# Altium schematic sheet Processing.SchDoc
size A3
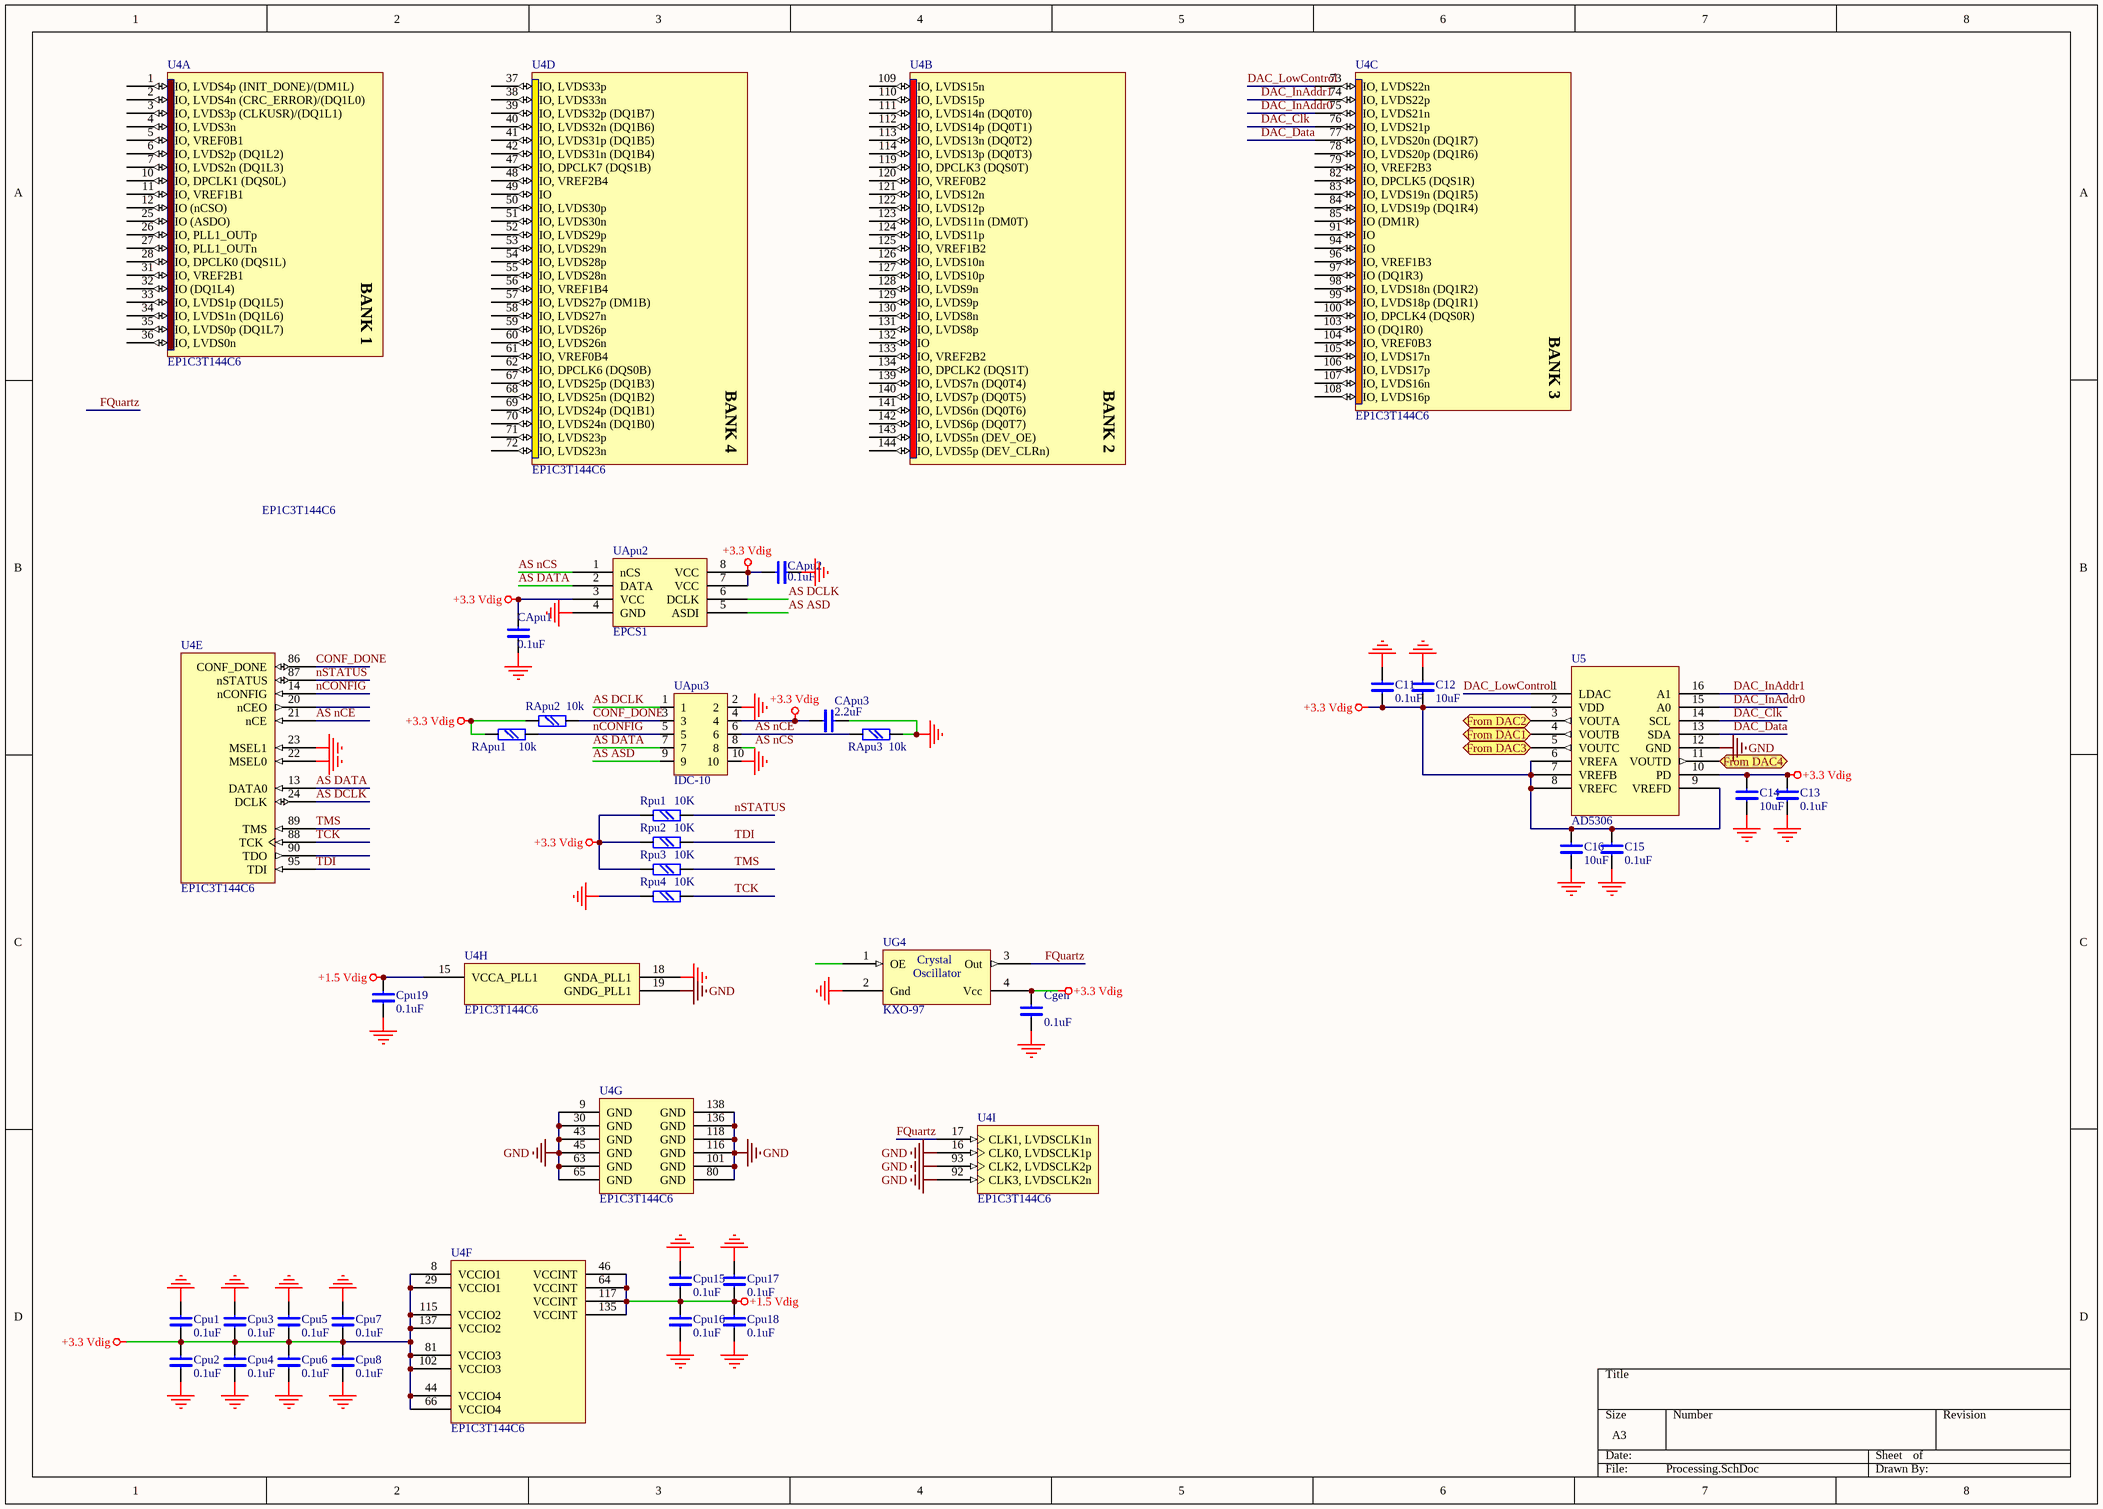
[diagram p0: Processing.SchDoc]

## Parts
C11  0.1uF  [chip0805]
C12  10uF  [chip1206]
C13  0.1uF  [chip0805]
C14  10uF  [chip1206]
C15  0.1uF  [chip0805]
C16  10uF  [chip1206]
CApu1  0.1uF  [chip0805]
CApu2  0.1uF  [chip0805]
CApu3  2.2uF  [chip0805]
Cgen  0.1uF  [chip0805]
Cpu1  0.1uF  [chip0805]
Cpu2  0.1uF  [chip0805]
Cpu3  0.1uF  [chip0805]
Cpu4  0.1uF  [chip0805]
Cpu5  0.1uF  [chip0805]
Cpu6  0.1uF  [chip0805]
Cpu7  0.1uF  [chip0805]
Cpu8  0.1uF  [chip0805]
Cpu15  0.1uF  [chip0805]
Cpu16  0.1uF  [chip0805]
Cpu17  0.1uF  [chip0805]
Cpu18  0.1uF  [chip0805]
Cpu19  0.1uF  [chip0805]
RApu1  10k  [chip0805]
RApu2  10k  [chip0805]
RApu3  10k  [chip0805]
Rpu1  10K  [chip0805]
Rpu2  10K  [chip0805]
Rpu3  10K  [chip0805]
Rpu4  10K  [chip0805]
U4  EP1C3T144C6  [TQFP144_N]  (parts A,B,C,D,E,F,G,H,I of 9)
U5  AD5306  [RU-16]
UApu2  EPCS1  [8SO200]
UApu3  IDC-10  [IDC10]
UG4  KXO-97  [SG-636]

## Ports
From DAC1 (out), From DAC2 (out), From DAC3 (out), From DAC4 (out)

## Nets
+1.5 Vdig: Cpu15.1 Cpu16.1 Cpu17.1 Cpu18.1 Cpu19.1 U4.15(VCCA_PLL1) U4.46(VCCINT) U4.64(VCCINT) U4.117(VCCINT) U4.135(VCCINT)
+3.3 Vdig: C11.1 C12.1 C13.1 C14.1 C15.1 C16.1 CApu1.2 CApu2.2 CApu3.1 Cgen.2 Cpu1.1 Cpu2.1 Cpu3.1 Cpu4.1 Cpu5.1 Cpu6.1 Cpu7.1 Cpu8.1 RApu1.1 RApu2.1 Rpu1.1 Rpu2.1 Rpu3.1 U4.8(VCCIO1) U4.29(VCCIO1) U4.44(VCCIO4) U4.66(VCCIO4) U4.81(VCCIO3) U4.102(VCCIO3) U4.115(VCCIO2) U4.137(VCCIO2) U5.2(VDD) U5.6(VREFA) U5.7(VREFB) U5.8(VREFC) U5.9(VREFD) U5.10(PD) UApu2.3(VCC) UApu2.7(VCC) UApu2.8(VCC) UApu3.4 UG4.4(Vcc)
GND: C11.2 C12.2 C13.2 C14.2 C15.2 C16.2 CApu1.1 CApu2.1 CApu3.2 Cgen.1 Cpu1.2 Cpu2.2 Cpu3.2 Cpu4.2 Cpu5.2 Cpu6.2 Cpu7.2 Cpu8.2 Cpu15.2 Cpu16.2 Cpu17.2 Cpu18.2 Cpu19.2 RApu3.2 Rpu4.1 U4.9(GND) U4.16(CLK0,_LVDSCLK1p) U4.18(GNDA_PLL1) U4.19(GNDG_PLL1) U4.22(MSEL0) U4.23(MSEL1) U4.30(GND) U4.43(GND) U4.45(GND) U4.63(GND) U4.65(GND) U4.80(GND) U4.92(CLK3,_LVDSCLK2n) U4.93(CLK2,_LVDSCLK2p) U4.101(GND) U4.116(GND) U4.118(GND) U4.136(GND) U4.138(GND) U5.12(GND) UApu2.4(GND) UApu3.2 UApu3.10 UG4.2(Gnd)
AS ASD: UApu2.5(ASDI) UApu3.9
AS DATA: U4.13(DATA0) UApu2.2(DATA) UApu3.7
AS DCLK: U4.24(DCLK) UApu2.6(DCLK) UApu3.1
AS nCE: RApu3.1 U4.21(nCE) UApu3.6
AS nCS: UApu2.1(nCS) UApu3.8
CONF_DONE: RApu2.2 U4.86(CONF_DONE) UApu3.3
DAC_Clk: U4.76(IO,_LVDS21p) U5.14(SCL)
DAC_Data: U4.77(IO,_LVDS20n_(DQ1R7)) U5.13(SDA)
DAC_InAddr0: U4.75(IO,_LVDS21n) U5.15(A0)
DAC_InAddr1: U4.74(IO,_LVDS22p) U5.16(A1)
DAC_LowControl: U4.73(IO,_LVDS22n) U5.1(LDAC)
FQuartz: U4.17(CLK1,_LVDSCLK1n) UG4.3(Out)
From DAC1: U5.4(VOUTB) ; port From DAC1
From DAC2: U5.3(VOUTA) ; port From DAC2
From DAC3: U5.5(VOUTC) ; port From DAC3
From DAC4: U5.11(VOUTD) ; port From DAC4
nCONFIG: RApu1.2 U4.14(nCONFIG) UApu3.5
nSTATUS: Rpu1.2 U4.87(nSTATUS)
TCK: Rpu4.2 U4.88(TCK)
TDI: Rpu2.2 U4.95(TDI)
TMS: Rpu3.2 U4.89(TMS)

Not connected (* = marked no-connect by the designer): U4 1(IO,_LVDS4p_(INIT_DONE)/(DM1L)) 2(IO,_LVDS4n_(CRC_ERROR)/(DQ1L0)) 3(IO,_LVDS3p_(CLKUSR)/(DQ1L1)) 4(IO,_LVDS3n) 5(IO,_VREF0B1) 6(IO,_LVDS2p_(DQ1L2)) 7(IO,_LVDS2n_(DQ1L3)) 10(IO,_DPCLK1_(DQS0L)) 11(IO,_VREF1B1) 12(IO_(nCSO)) 20(nCEO) 25(IO_(ASDO)) 26(IO,_PLL1_OUTp) 27(IO,_PLL1_OUTn) 28(IO,_DPCLK0_(DQS1L)) 31(IO,_VREF2B1) 32(IO_(DQ1L4)) 33(IO,_LVDS1p_(DQ1L5)) 34(IO,_LVDS1n_(DQ1L6)) 35(IO,_LVDS0p_(DQ1L7)) 36(IO,_LVDS0n) 37(IO,_LVDS33p) 38(IO,_LVDS33n) 39(IO,_LVDS32p_(DQ1B7)) 40(IO,_LVDS32n_(DQ1B6)) 41(IO,_LVDS31p_(DQ1B5)) 42(IO,_LVDS31n_(DQ1B4)) 47(IO,_DPCLK7_(DQS1B)) 48(IO,_VREF2B4) 49(IO) 50(IO,_LVDS30p) 51(IO,_LVDS30n) 52(IO,_LVDS29p) 53(IO,_LVDS29n) 54(IO,_LVDS28p) 55(IO,_LVDS28n) 56(IO,_VREF1B4) 57(IO,_LVDS27p_(DM1B)) 58(IO,_LVDS27n) 59(IO,_LVDS26p) 60(IO,_LVDS26n) 61(IO,_VREF0B4) 62(IO,_DPCLK6_(DQS0B)) 67(IO,_LVDS25p_(DQ1B3)) 68(IO,_LVDS25n_(DQ1B2)) 69(IO,_LVDS24p_(DQ1B1)) 70(IO,_LVDS24n_(DQ1B0)) 71(IO,_LVDS23p) 72(IO,_LVDS23n) 78(IO,_LVDS20p_(DQ1R6)) 79(IO,_VREF2B3) 82(IO,_DPCLK5_(DQS1R)) 83(IO,_LVDS19n_(DQ1R5)) 84(IO,_LVDS19p_(DQ1R4)) 85(IO_(DM1R)) 90(TDO) 91(IO) 94(IO) 96(IO,_VREF1B3) 97(IO_(DQ1R3)) 98(IO,_LVDS18n_(DQ1R2)) 99(IO,_LVDS18p_(DQ1R1)) 100(IO,_DPCLK4_(DQS0R)) 103(IO_(DQ1R0)) 104(IO,_VREF0B3) 105(IO,_LVDS17n) 106(IO,_LVDS17p) 107(IO,_LVDS16n) 108(IO,_LVDS16p) 109(IO,_LVDS15n) 110(IO,_LVDS15p) 111(IO,_LVDS14n_(DQ0T0)) 112(IO,_LVDS14p_(DQ0T1)) 113(IO,_LVDS13n_(DQ0T2)) 114(IO,_LVDS13p_(DQ0T3)) 119(IO,_DPCLK3_(DQS0T)) 120(IO,_VREF0B2) 121(IO,_LVDS12n) 122(IO,_LVDS12p) 123(IO,_LVDS11n_(DM0T)) 124(IO,_LVDS11p) 125(IO,_VREF1B2) 126(IO,_LVDS10n) 127(IO,_LVDS10p) 128(IO,_LVDS9n) 129(IO,_LVDS9p) 130(IO,_LVDS8n) 131(IO,_LVDS8p) 132(IO) 133(IO,_VREF2B2) 134(IO,_DPCLK2_(DQS1T)) 139(IO,_LVDS7n_(DQ0T4)) 140(IO,_LVDS7p_(DQ0T5)) 141(IO,_LVDS6n_(DQ0T6)) 142(IO,_LVDS6p_(DQ0T7)) 143(IO,_LVDS5n_(DEV_OE)) 144(IO,_LVDS5p_(DEV_CLRn)); UG4 1(OE)

## Notes on the sheet
- (in symbol EP1C3T144C6, part A) BANK 1
- (in symbol EP1C3T144C6, part B) BANK 2
- (in symbol EP1C3T144C6, part C) BANK 3
- (in symbol EP1C3T144C6, part D) BANK 4
- (in symbol SG-636) Crystal; Oscillator

## Library data of the parts
C11-C16 CApu1-CApu3 Cgen Cpu1-Cpu8 Cpu15-Cpu19 = C: Text Field1: 20; Text Field2: 10
RApu1-RApu3 Rpu1-Rpu4 = R: Text Field1: 20; Text Field2: 20
U4 = EP1C3T144C6: Cyclone Family, 1.5V FPGA, 104 I/O Pins, 1 x PLL, Commercial Grade, Speed Grade 6; Published: 17-Sep-2003; LatestRevisionDate: 13-Apr-2006; LatestRevisionNote: Pin 2 name fix, IPC-7351 Footprint Added.; DatasheetVersion: ver2.4, May-2008; PackageVersion: ver15.4, Dec-2008; PackageReference: TQFP144; Publisher: Altium Limited; PackageDescription: 144-Pin Plastic Thin Quad Flat Pack (TQFP144) - Wire Bond; Supplier 1: Digi-Key; Supplier Part Number 1: 544-1050-ND; Supplier 2: Farnell; Supplier Part Number 2: 6489280; Code_JEDEC: MS-026-BFB; ComponentLink1Description: Manufacturer Link; ComponentLink1URL: http://www.altera.com/products/devices/cyclone/cyc-index.jsp; ComponentLink2Description: Handbook; ComponentLink2URL: http://www.altera.com/literature/hb/cyc/cyc_c5v1.pdf; ComponentLink3Description: Packaging Specification; ComponentLink3URL: http://www.altera.com/literature/ds/dspkg.pdf
UApu2 = EPCS1: Serial configuration device for Cyclone (Altera)
UApu3 = IDC-10: Text Field1: 40; Text Field2: 60
UG4 = SG-636: Crystal Oscillator (SMD)